# EasyEDA schematic SCH_bidouille_noel_2026-01-31.json
TITLE: Sheet_1; REV: 1.0; Date: 2025-11-10; Sheet: 1/1; Drawn By: tcccorp; Company: Your Company
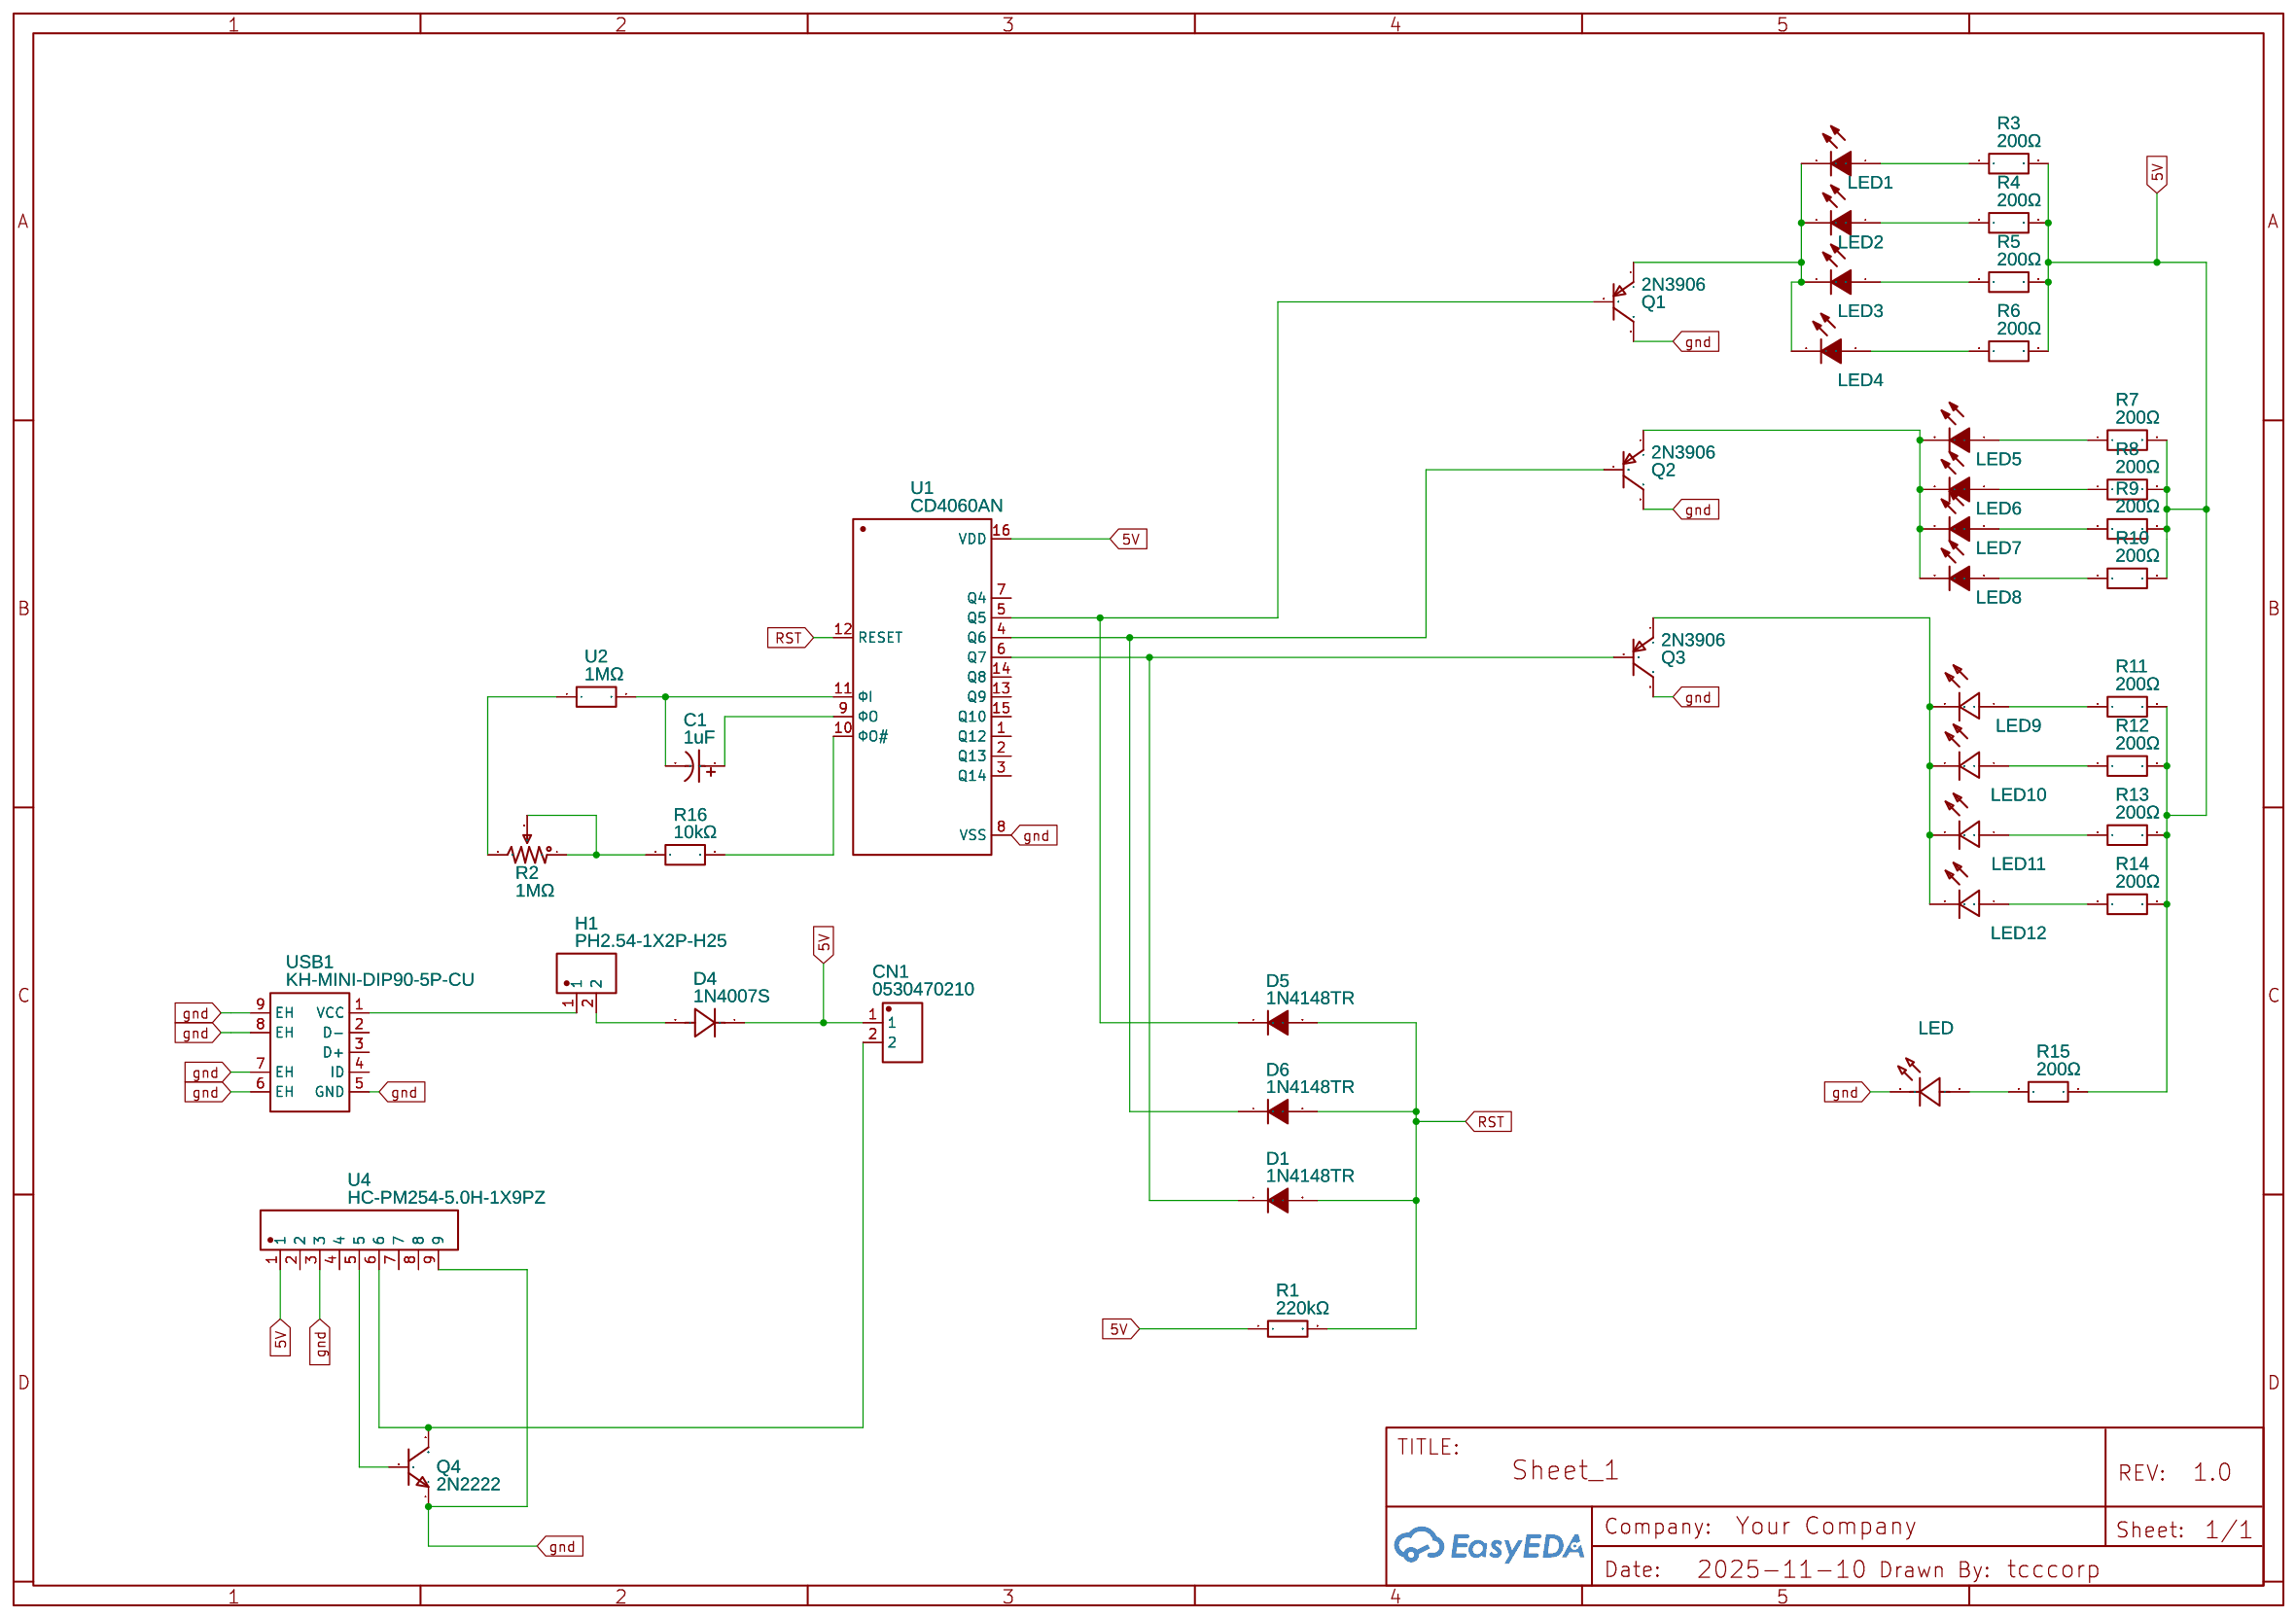
[diagram p0: schematic sheet]

## Parts
C1  1uF  [CAP-TH_BD6.3-P2.50-D1.0-FD]
CN1  0530470210  [CONN-TH_0530470210]
D1  1N4148TR  [DO-35_BD2.0-L4.2-P8.20-D0.5-RD]
D4  1N4007S  [DO-41_BD2.4-L4.7-P8.70-D0.6-RD]
D5  1N4148TR  [DO-35_BD2.0-L4.2-P8.20-D0.5-RD]
D6  1N4148TR  [DO-35_BD2.0-L4.2-P8.20-D0.5-RD]
H1  PH2.54-1X2P-H25  [HDR-TH_2P-P2.54-V-M-4]
LED  TJ-L5FPTGCRMFCSFLC2R-A5  [LED-TH_BD5.8-P2.54-FD]
LED1  204-10SURD/S530-A3  [LED-TH_BD3.0-P2.54-FD]
LED2  204-10SURD/S530-A3  [LED-TH_BD3.0-P2.54-FD]
LED3  204-10SURD/S530-A3  [LED-TH_BD3.0-P2.54-FD]
LED4  204-10SURD/S530-A3  [LED-TH_BD3.0-P2.54-FD]
LED5  204-10SURD/S530-A3  [LED-TH_BD3.0-P2.54-FD]
LED6  204-10SURD/S530-A3  [LED-TH_BD3.0-P2.54-FD]
LED7  204-10SURD/S530-A3  [LED-TH_BD3.0-P2.54-FD]
LED8  204-10SURD/S530-A3  [LED-TH_BD3.0-P2.54-FD]
LED9  204-10UYT/S530-A3  [LED-TH_BD4.0-P2.54-FD]
LED10  204-10UYT/S530-A3  [LED-TH_BD4.0-P2.54-FD]
LED11  204-10UYT/S530-A3  [LED-TH_BD4.0-P2.54-FD]
LED12  204-10UYT/S530-A3  [LED-TH_BD4.0-P2.54-FD]
Q1  2N3906  [TO-92-3_L4.9-W3.7-P1.27-L]
Q2  2N3906  [TO-92-3_L4.9-W3.7-P1.27-L]
Q3  2N3906  [TO-92-3_L4.9-W3.7-P1.27-L]
Q4  2N2222  [TO-92-3_L4.9-W3.7-P1.27-L]
R1  220kΩ  [RES-TH_BD2.2-L6.5-P10.50-D0.6]
R2  1MΩ  [RES-ADJ-TH_3296W]
R3  200Ω  [RES-TH_BD2.7-L6.2-P10.20-D0.4]
R4  200Ω  [RES-TH_BD2.7-L6.2-P10.20-D0.4]
R5  200Ω  [RES-TH_BD2.7-L6.2-P10.20-D0.4]
R6  200Ω  [RES-TH_BD2.7-L6.2-P10.20-D0.4]
R7  200Ω  [RES-TH_BD2.7-L6.2-P10.20-D0.4]
R8  200Ω  [RES-TH_BD2.7-L6.2-P10.20-D0.4]
R9  200Ω  [RES-TH_BD2.7-L6.2-P10.20-D0.4]
R10  200Ω  [RES-TH_BD2.7-L6.2-P10.20-D0.4]
R11  200Ω  [RES-TH_BD2.7-L6.2-P10.20-D0.4]
R12  200Ω  [RES-TH_BD2.7-L6.2-P10.20-D0.4]
R13  200Ω  [RES-TH_BD2.7-L6.2-P10.20-D0.4]
R14  200Ω  [RES-TH_BD2.7-L6.2-P10.20-D0.4]
R15  200Ω  [RES-TH_BD2.7-L6.2-P10.20-D0.4]
R16  10kΩ  [RES-TH_BD2.4-L6.3-P10.30-D0.6]
U1  CD4060AN  [PDIP-16_L19.7-W6.6-P2.54-LS7.6-BL]
U2  1MΩ  [RES-TH_BD2.7-L6.2-P10.20-D0.4]
U4  HC-PM254-5.0H-1X9PZ  [CONN-TH_HC-PM254-5.0H-1X9PZ]
USB1  KH-MINI-DIP90-5P-CU  [MINI-USB-TH_KH-MINI-DIP90-5P-CU]

## Library data of the parts
C1 = 1uF 400V 6.3*12: Supplier: LCSC; Manufacturer: Chengx(承兴); Manufacturer Part: KM105M400E12RR0VH2FP0; Supplier Part: C46093; JLCPCB Part Class: Extended Part
CN1 = 0530470210: Contributor: LCSC; Supplier: LCSC; Manufacturer: MOLEX; Manufacturer Part: 530470210; Supplier Part: C114130; JLCPCB Part Class: Extended Part
D1 D5 D6 = 1N4148TR: Supplier: LCSC; Manufacturer: onsemi(安森美); Supplier Part: C84410; JLCPCB Part Class: Extended Part
D4 = 1N4007S: Contributor: lcsc; Supplier: LCSC; Supplier Part: C2992088; Manufacturer: 星海; JLCPCB Part Class: Extended Part
H1 = PH2.54-1X2P-H25: Supplier: LCSC; Supplier Part: C42431798; Manufacturer: JXTCONN(聚兴泰); Contributor: lcsc; JLCPCB Part Class: Extended Part
LED = TJ-L5FPTGCRMFCSFLC2R-A5: Contributor: lcsc; Supplier: LCSC; Supplier Part: C331030; Manufacturer: TOGIALED(统佳); JLCPCB Part Class: Extended Part
LED1-LED8 = 204-10SURD/S530-A3: Supplier: LCSC; Manufacturer: EVERLIGHT(亿光); Supplier Part: C99772; JLCPCB Part Class: Extended Part
LED9-LED12 = 204-10UYT/S530-A3: Contributor: LCSC; Supplier: LCSC; Supplier Part: C282137; Manufacturer: EVERLIGHT(亿光); JLCPCB Part Class: Extended Part
Q1-Q3 = 2N3906: Supplier: LCSC; Manufacturer: CJ(江苏长电/长晶); Manufacturer Part: 2N3906(RANGE:200-300); Supplier Part: C9809; JLCPCB Part Class: Extended Part
Q4 = 2N2222: Contributor: LCSC; Supplier: LCSC; Manufacturer: ST(先科); Manufacturer Part: 2N2222A; Supplier Part: C118536; JLCPCB Part Class: Extended Part
R1 = MFR0W4F2203A50: Supplier: LCSC; Manufacturer: UNI-ROYAL(厚声); Supplier Part: C58662; JLCPCB Part Class: Extended Part
R2 = 3296W-1-105_C48997935: Supplier: LCSC; Supplier Part: C48997935; Manufacturer: JIERR(捷而瑞); Manufacturer Part: 3296W-1-105; JLCPCB Part Class: Extended Part; Contributor: lcsc
R3-R15 = CR1/4W-200Ω±5%-ST52: Contributor: lcsc; Supplier: LCSC; Supplier Part: C2894669; Manufacturer: VO(翔胜); JLCPCB Part Class: Extended Part
R16 = RN 1/4W 10K F T/B A1: Contributor: LCSC; Supplier: LCSC; Supplier Part: C410695; Manufacturer: Tyohm(幸亚电阻); Manufacturer Part: RN1/4W10KFT/BA1; JLCPCB Part Class: Extended Part
U1 = CD4060AN: Supplier: LCSC; Supplier Part: C47148931; Manufacturer: HGSEMI(华冠); Contributor: lcsc; JLCPCB Part Class: Extended Part
U2 = MF1/4W-1M±1%-OT52: Contributor: lcsc; Supplier: LCSC; Supplier Part: C2903250; Manufacturer: VO(翔胜); JLCPCB Part Class: Extended Part
U4 = HC-PM254-5.0H-1X9PZ: Supplier: LCSC; Supplier Part: C27985234; Manufacturer: HC(虹成电子); Manufacturer Part: HC-PM254-5.0H-1x9PZ; JLCPCB Part Class: Extended Part; Contributor: lcsc
USB1 = KH-MINI-DIP90-5P-CU: Contributor: LCSC; Supplier: LCSC; Supplier Part: C2688796; Manufacturer: kinghelm(金航标); Manufacturer Part: KH-MINI-DIP90-5P-Cu; JLCPCB Part Class: Extended Part

## Nets
5V: CN1.1 D4.1(K) R1.1 R3.2 R4.2 R5.2 R6.2 R7.2 R8.2 R9.2 R10.2 R11.2 R12.2 R13.2 R14.2 R15.2 U1.16(VDD) U4.1
gnd: LED.2(K) Q1.3(C) Q2.3(C) Q3.3(C) Q4.1(E) U1.8(VSS) U4.3 U4.9 USB1.5(GND) USB1.6(EH) USB1.7(EH) USB1.8(EH) USB1.9(EH)
RST: D1.2(A) D5.2(A) D6.2(A) R1.2 U1.12(RESET)
Net-(C1-1): C1.1 U1.9(ФO)
Net-(C1-2): C1.2 U1.11(ФI) U2.2
Net-(CN1-2): CN1.2 Q4.3(C) U4.6
Net-(D1-1): D1.1(C) Q3.2(B) U1.6(Q7)
Net-(D4-2): D4.2(A) H1.2
Net-(D5-1): D5.1(C) Q1.2(B) U1.5(Q5)
Net-(D6-1): D6.1(C) Q2.2(B) U1.4(Q6)
Net-(H1-1): H1.1 USB1.1(VCC)
Net-(LED1-1): LED1.1(A) R3.1
Net-(LED1-2): LED1.2(K) LED2.2(K) LED3.2(K) LED4.2(K) Q1.1(E)
Net-(LED2-1): LED2.1(A) R4.1
Net-(LED3-1): LED3.1(A) R5.1
Net-(LED4-1): LED4.1(A) R6.1
Net-(LED5-1): LED5.1(A) R7.1
Net-(LED5-2): LED5.2(K) LED6.2(K) LED7.2(K) LED8.2(K) Q2.1(E)
Net-(LED6-1): LED6.1(A) R8.1
Net-(LED7-1): LED7.1(A) R9.1
Net-(LED8-1): LED8.1(A) R10.1
Net-(LED9-1): LED9.1 R11.1
Net-(LED9-2): LED9.2 LED10.2 LED11.2 LED12.2 Q3.1(E)
Net-(LED10-1): LED10.1 R12.1
Net-(LED11-1): LED11.1 R13.1
Net-(LED12-1): LED12.1 R14.1
Net-(LED-1): LED.1(A) R15.1
Net-(Q4-2): Q4.2(B) U4.5
Net-(R2-1): R2.1 R2.2 R16.1
Net-(R2-3): R2.3 U2.1
Net-(R16-2): R16.2 U1.10(ФO#)

Not connected (* = marked no-connect by the designer): U1 1(Q12) 2(Q13) 3(Q14) 7(Q4) 13(Q9) 14(Q8) 15(Q10); U4 2 4 7 8; USB1 2(D-) 3(D+) 4(ID)
